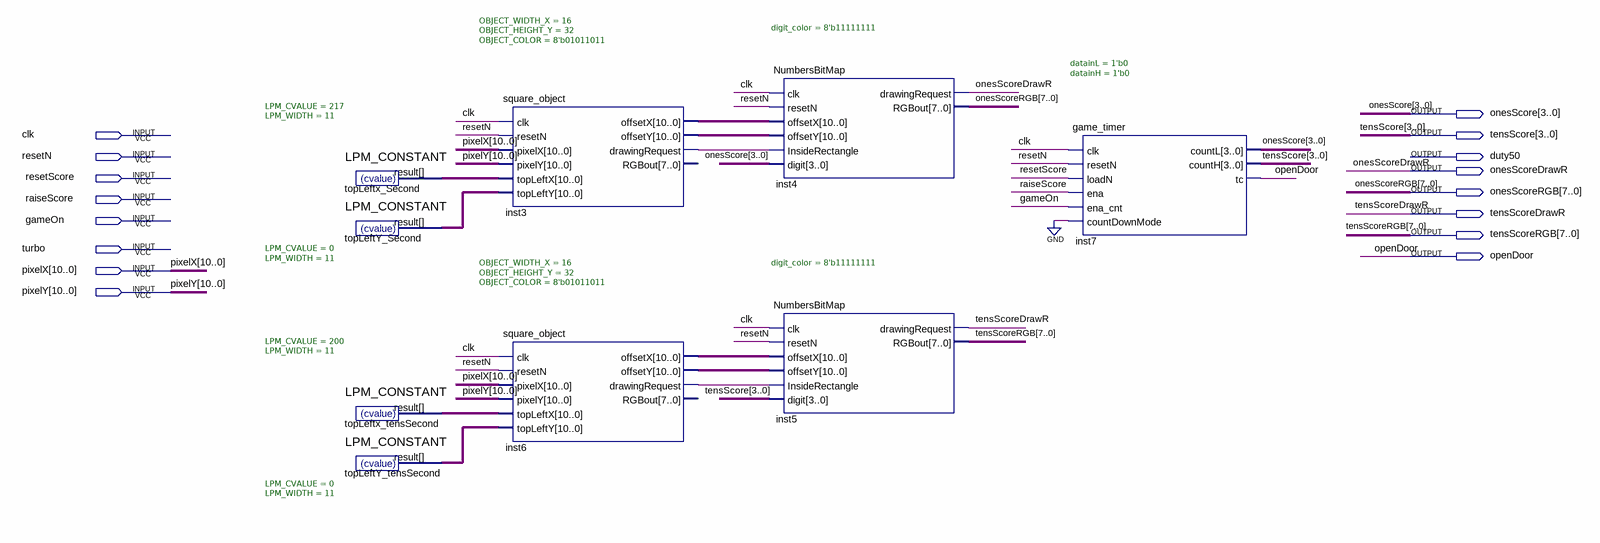
[diagram p0: schematic sheet]
// Quartus schematic scoreTop.bdf as structural Verilog: 9 symbols, 16 pins
module scoreTop (
  input  clk,
  input  resetN,
  input  resetScore,
  input  raiseScore,
  input  gameOn,
  input  turbo,
  input  [10:0] pixelX,
  input  [10:0] pixelY,
  output [3:0] onesScore,
  output [3:0] tensScore,
  output duty50,
  output onesScoreDrawR,
  output [7:0] onesScoreRGB,
  output tensScoreDrawR,
  output [7:0] tensScoreRGB,
  output openDoor
);

  wire inst3_drawingrequest, inst6_drawingrequest;
  wire [10:0] inst3_offsetx, inst3_offsety, inst6_offsetx, inst6_offsety, topLeftx_Second_result,
       topLeftx_tensSecond_result, topLeftY_Second_result, topLeftY_tensSecond_result;

  LPM_CONSTANT #(.LPM_CVALUE(217), .LPM_WIDTH(11)) topLeftx_Second (.result(topLeftx_Second_result));
  LPM_CONSTANT #(.LPM_CVALUE(0), .LPM_WIDTH(11)) topLeftY_Second (.result(topLeftY_Second_result));
  LPM_CONSTANT #(.LPM_CVALUE(200), .LPM_WIDTH(11)) topLeftx_tensSecond (.result(topLeftx_tensSecond_result));
  LPM_CONSTANT #(.LPM_CVALUE(0), .LPM_WIDTH(11)) topLeftY_tensSecond (.result(topLeftY_tensSecond_result));
  square_object #(.OBJECT_WIDTH_X(16), .OBJECT_HEIGHT_Y(32), .OBJECT_COLOR(8'b01011011)) inst3 (
    .clk(clk), .resetN(resetN), .pixelX(pixelX), .pixelY(pixelY), .topLeftX(topLeftx_Second_result),
    .topLeftY(topLeftY_Second_result), .offsetX(inst3_offsetx), .offsetY(inst3_offsety),
    .drawingRequest(inst3_drawingrequest));  // open: RGBout
  square_object #(.OBJECT_WIDTH_X(16), .OBJECT_HEIGHT_Y(32), .OBJECT_COLOR(8'b01011011)) inst6 (
    .clk(clk), .resetN(resetN), .pixelX(pixelX), .pixelY(pixelY), .topLeftX(topLeftx_tensSecond_result),
    .topLeftY(topLeftY_tensSecond_result), .offsetX(inst6_offsetx), .offsetY(inst6_offsety),
    .drawingRequest(inst6_drawingrequest));  // open: RGBout
  NumbersBitMap #(.digit_color(8'b11111111)) inst4 (
    .clk(clk), .resetN(resetN), .offsetX(inst3_offsetx), .offsetY(inst3_offsety),
    .InsideRectangle(inst3_drawingrequest), .digit(onesScore), .drawingRequest(onesScoreDrawR),
    .RGBout(onesScoreRGB));
  NumbersBitMap #(.digit_color(8'b11111111)) inst5 (
    .clk(clk), .resetN(resetN), .offsetX(inst6_offsetx), .offsetY(inst6_offsety),
    .InsideRectangle(inst6_drawingrequest), .digit(tensScore), .drawingRequest(tensScoreDrawR),
    .RGBout(tensScoreRGB));
  game_timer #(.datainL(1'b0), .datainH(1'b0)) inst7 (
    .clk(clk), .resetN(resetN), .loadN(resetScore), .ena(raiseScore), .ena_cnt(gameOn), .countDownMode(1'b0),
    .countL(onesScore), .countH(tensScore), .tc(openDoor));
endmodule
